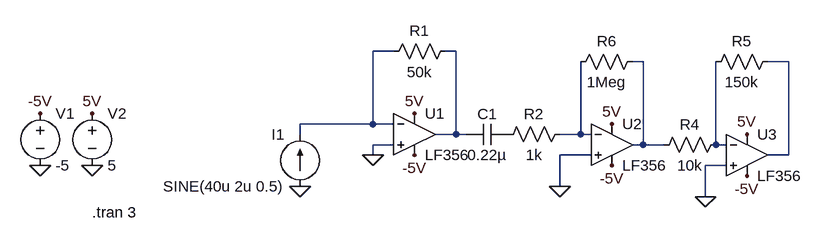
[diagram p0: schematic SigAmp.asc]
SigAmp.asc, the LTspice schematic file:
Version 4
SHEET 1 900 680
WIRE 288 48 256 48
WIRE 384 48 368 48
WIRE 672 64 656 64
WIRE 896 64 864 64
WIRE 256 160 256 48
WIRE 256 160 144 160
WIRE 288 160 256 160
WIRE 144 176 144 160
WIRE 384 176 384 48
WIRE 384 176 352 176
WIRE 400 176 384 176
WIRE 576 176 576 64
WIRE 576 176 544 176
WIRE 592 176 576 176
WIRE 288 192 256 192
WIRE 672 192 672 64
WIRE 672 192 656 192
WIRE 704 192 672 192
WIRE 784 192 784 64
WIRE 800 192 784 192
WIRE 256 208 256 192
WIRE 592 208 544 208
WIRE 896 208 896 64
WIRE 896 208 864 208
WIRE 800 224 768 224
WIRE 544 256 544 208
WIRE 768 272 768 224
FLAG -256 224 0
FLAG -176 224 0
FLAG -176 144 5V
FLAG 320 144 5V
FLAG -256 144 -5V
FLAG 320 208 -5V
FLAG 256 208 0
FLAG 144 256 0
FLAG 624 160 5V
FLAG 624 224 -5V
FLAG 768 272 0
FLAG 832 240 -5V
FLAG 832 176 5V
FLAG 544 256 0
SYMBOL LF356 320 112 R0
SYMATTR InstName U1
SYMBOL voltage -256 128 R0
WINDOW 123 0 0 Left 0
WINDOW 39 0 0 Left 0
SYMATTR InstName V1
SYMATTR Value -5
SYMBOL voltage -176 128 R0
WINDOW 123 0 0 Left 0
WINDOW 39 0 0 Left 0
SYMATTR InstName V2
SYMATTR Value 5
SYMBOL current 144 256 R180
WINDOW 0 24 80 Left 2
WINDOW 3 24 0 Left 2
WINDOW 123 0 0 Left 0
WINDOW 39 0 0 Left 0
SYMATTR InstName I1
SYMATTR Value SINE(40u 2u 0.5)
SYMBOL res 384 32 R90
WINDOW 0 0 56 VBottom 2
WINDOW 3 32 56 VTop 2
SYMATTR InstName R1
SYMATTR Value 50k
SYMBOL cap 464 160 R90
WINDOW 0 0 32 VBottom 2
WINDOW 3 32 32 VTop 2
SYMATTR InstName C1
SYMATTR Value 0.22µ
SYMBOL LF356 624 128 R0
SYMATTR InstName U2
SYMBOL LF356 832 144 R0
SYMATTR InstName U3
SYMBOL res 800 176 R90
WINDOW 0 0 56 VBottom 2
WINDOW 3 32 56 VTop 2
SYMATTR InstName R4
SYMATTR Value 10k
SYMBOL res 880 48 R90
WINDOW 0 0 56 VBottom 2
WINDOW 3 32 56 VTop 2
SYMATTR InstName R5
SYMATTR Value 150k
SYMBOL res 672 48 R90
WINDOW 0 0 56 VBottom 2
WINDOW 3 32 56 VTop 2
SYMATTR InstName R6
SYMATTR Value 1Meg
SYMBOL res 560 160 R90
WINDOW 0 0 56 VBottom 2
WINDOW 3 32 56 VTop 2
SYMATTR InstName R2
SYMATTR Value 1k
TEXT -176 296 Left 2 !.tran 3

The netlist it stands for:
* SigAmp.asc
XU1 0 N001 5V -5V N002 LF356  ; pins In+ In- V+ V- OUT
V1 -5V 0 -5
V2 5V 0 5
I1 0 N001 SINE(40u 2u 0.5)
R1 N002 N001 50k
C1 P001 N002 0.22µ
XU2 0 N005 5V -5V N003 LF356  ; pins In+ In- V+ V- OUT
XU3 0 N006 5V -5V N004 LF356  ; pins In+ In- V+ V- OUT
R4 N006 N003 10k
R5 N004 N006 150k
R6 N003 N005 1Meg
R2 N005 P001 1k
.tran 3
.lib LF356.sub
.backanno
.end